# Altium schematic sheet DC075B_INPUT_CLOCKS.SchDoc: INPUT CLOCKS
size 558 x 431 mm; DrawnBy: Praveen Aroul; DocumentNumber: 3; SheetNumber: 3; SheetTotal: 13; PageSetup: Record=PageOptions|CenterHorizontal=True|CenterVertical=True|PrintScale=1.00|XCorrection=1.00|YCorrection=1.00|PrintKind=0|BorderSize=5000000|LeftOffset=0|BottomOffset=0|Orientation=2|PaperLength=1000|PaperWidth=1000|Scale=100|PaperSource=15|PrintQuality=600|MediaType=1|DitherType=10|PaperKind=Letter|PrintScaleMode=1
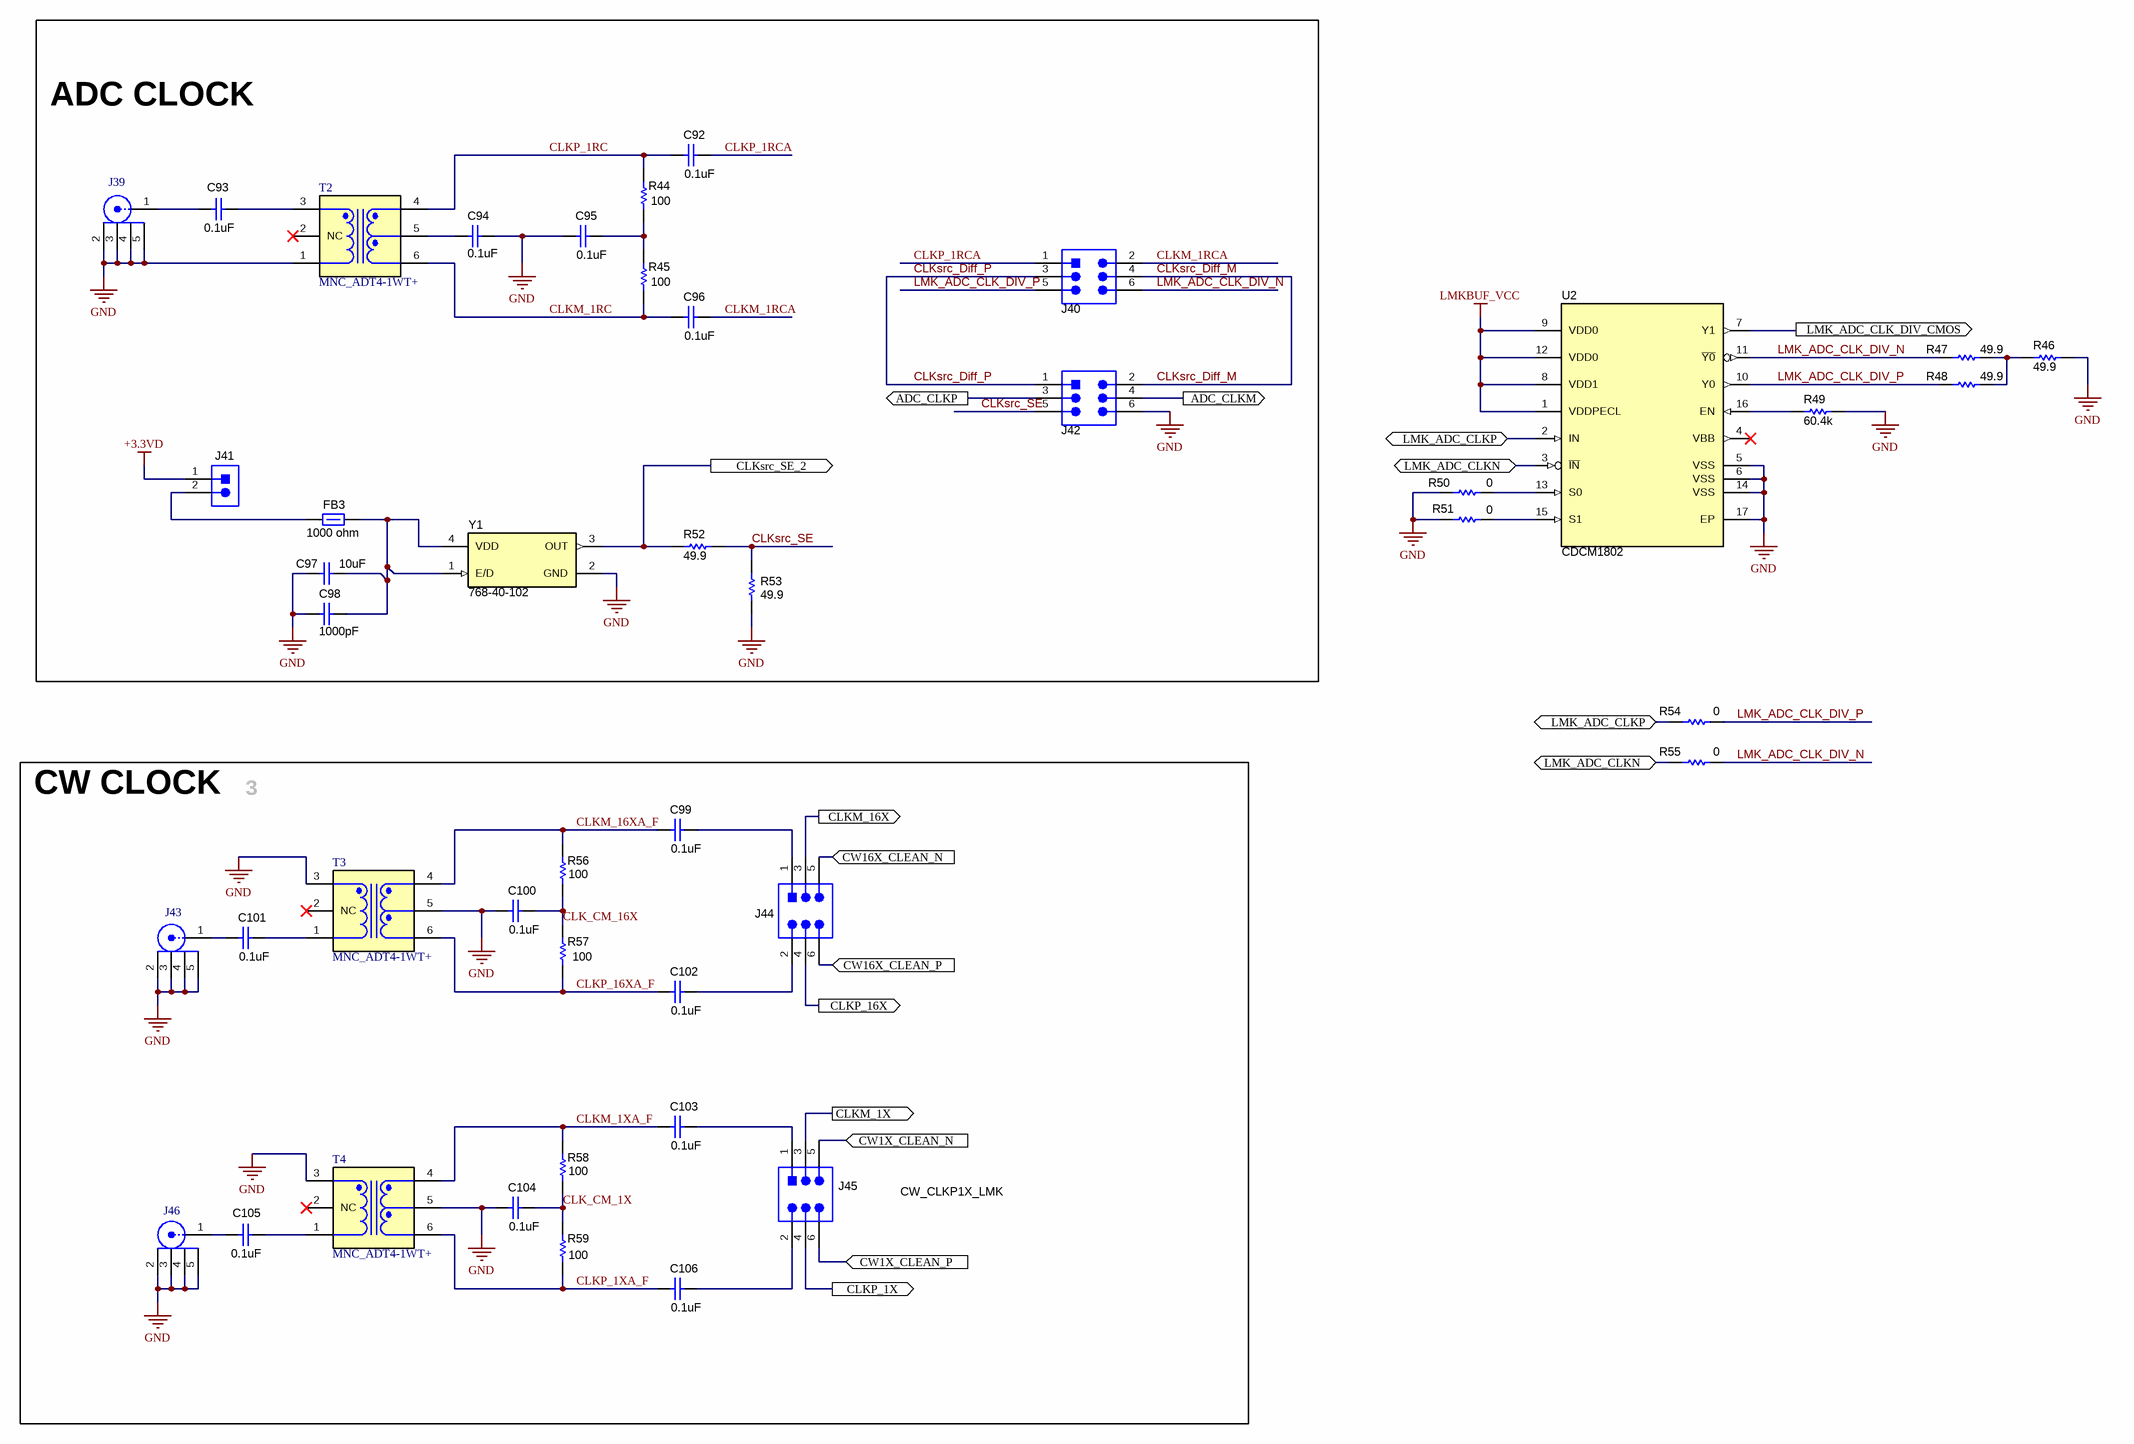
[diagram p0: DC075B_INPUT_CLOCKS.SchDoc]

## Parts
C92  value 0.1uF  [0402]  (hidden comment: Capacitor)
C93  value 0.1uF  [0402]  (hidden comment: Capacitor)
C94  value 0.1uF  [0402]  (hidden comment: Capacitor)
C95  value 0.1uF  [0402]  (hidden comment: Capacitor)
C96  value 0.1uF  [0402]  (hidden comment: Capacitor)
C97  value 10uF  [0603_HV]  (hidden comment: Capacitor)
C98  ValueDisplayed: 1000pF  [0402]  (hidden comment: 885012205044)
C99  value 0.1uF  [0402]  (hidden comment: Capacitor)
C100  value 0.1uF  [0402]  (hidden comment: Capacitor)
C101  value 0.1uF  [0402]  (hidden comment: Capacitor)
C102  value 0.1uF  [0402]  (hidden comment: Capacitor)
C103  value 0.1uF  [0402]  (hidden comment: Capacitor)
C104  value 0.1uF  [0402]  (hidden comment: Capacitor)
C105  value 0.1uF  [0402]  (hidden comment: Capacitor)
C106  value 0.1uF  [0402]  (hidden comment: Capacitor)
FB3  value 1000 ohm  [0402]  (hidden comment: Ferrite_Bead)
J39  5-1814832-1  [TE_5-1814832-1]  (value not drawn)
J40  Header_3x2  [TSW-103-07-G-D]  (value not drawn)
J41  Header_2x1  [TSW-102-07-G-S]  (value not drawn)
J42  Header_3x2  [TSW-103-07-G-D]  (value not drawn)
J43  5-1814832-1  [TE_5-1814832-1]  (value not drawn)
J44  Header_3x2  [TSW-103-07-G-D]  (value not drawn)
J45  Header_3x2  [TSW-103-07-G-D]  (value not drawn)
J46  5-1814832-1  [TE_5-1814832-1]  (value not drawn)
R44  ValueDisplayed: 100  [0402]  (hidden comment: Resistor)
R45  ValueDisplayed: 100  [0402]  (hidden comment: Resistor)
R46  value 49.9  [0402]  (hidden comment: Resistor)
R47  value 49.9  [0402]  (hidden comment: Resistor)
R48  value 49.9  [0402]  (hidden comment: Resistor)
R49  value 60.4k  [0402]  (hidden comment: Resistor)
R50  value 0  [0402]  (hidden comment: Resistor)
R51  value 0  [0402]  (hidden comment: Resistor)
R52  value 49.9  [0402]  (hidden comment: Resistor)
R53  value 49.9  [0402]  (hidden comment: Resistor)
R54  value 0  [0402]  (hidden comment: Resistor)
R55  value 0  [0402]  (hidden comment: Resistor)
R56  ValueDisplayed: 100  [0402]  (hidden comment: Resistor)
R57  ValueDisplayed: 100  [0402]  (hidden comment: Resistor)
R58  ValueDisplayed: 100  [0402]  (hidden comment: Resistor)
R59  ValueDisplayed: 100  [0402]  (hidden comment: Resistor)
T2  MNC_ADT4-1WT+  [MNC_CD542]
T3  MNC_ADT4-1WT+  [MNC_CD542]
T4  MNC_ADT4-1WT+  [MNC_CD542]
U2  CDCM1802  [RGT0016A]
Y1  768-40-102  [FOX_FXO-HC73]

## Blocks framed on the sheet
ADC CLOCK: C92-C98 FB3 J39-J42 R44 R45 R52 R53 T2 Y1
CW CLOCK: C99-C106 J43-J46 R56-R59 T3 T4

## Ports
ADC_CLKM (out), ADC_CLKP (out), CLKM_1X (out), CLKM_16X (out), CLKP_1X (out), CLKP_16X (out), CLKsrc_SE_2 (out), CW1X_CLEAN_N (in), CW1X_CLEAN_P (in), CW16X_CLEAN_N (in), CW16X_CLEAN_P (in), LMK_ADC_CLK_DIV_CMOS (out), LMK_ADC_CLKN, LMK_ADC_CLKP

## Nets
+3.3VD: J41.1
GND: C94.2 C95.2 C97.1 C98.1 C100.2 C104.2 J39.2 J39.3 J39.4 J39.5 J42.6 J43.2 J43.3 J43.4 J43.5 J46.2 J46.3 J46.4 J46.5 R46.2 R49.1 R50.1 R51.1 R53.2 T2.1 T3.3 T3.5 T4.3 T4.5 U2.5(VSS) U2.6(VSS) U2.14(VSS) U2.17(EP) Y1.2(GND)
LMKBUF_VCC: U2.1(VDDPECL) U2.8(VDD1) U2.9(VDD0) U2.12(VDD0)
ADC_CLKM: J42.4 ; port ADC_CLKM
ADC_CLKP: J42.3 ; port ADC_CLKP
CLK_CM_1X: C104.1 R58.1 R59.2
CLK_CM_16X: C100.1 R56.1 R57.2
CLKM_1RC: C96.2 R45.2 T2.6
CLKM_1RCA: C96.1 J40.2
CLKM_1X: J45.3 ; port CLKM_1X
CLKM_1XA_F: C103.2 R58.2 T4.4
CLKM_16X: J44.3 ; port CLKM_16X
CLKM_16XA_F: C99.2 R56.2 T3.4
CLKP_1RC: C92.2 R44.1 T2.4
CLKP_1RCA: C92.1 J40.1
CLKP_1X: J45.4 ; port CLKP_1X
CLKP_1XA_F: C106.2 R59.1 T4.6
CLKP_16X: J44.4 ; port CLKP_16X
CLKP_16XA_F: C102.2 R57.1 T3.6
CLKsrc_Diff_M: J40.4 J42.2
CLKsrc_Diff_P: J40.3 J42.1
CLKsrc_SE: J42.5 R52.2 R53.1
CLKsrc_SE_2: R52.1 Y1.3(OUT) ; port CLKsrc_SE_2
CW1X_CLEAN_N: J45.5 ; port CW1X_CLEAN_N
CW1X_CLEAN_P: J45.6 ; port CW1X_CLEAN_P
CW16X_CLEAN_N: J44.5 ; port CW16X_CLEAN_N
CW16X_CLEAN_P: J44.6 ; port CW16X_CLEAN_P
LMK_ADC_CLK_DIV_CMOS: U2.7(Y1) ; port LMK_ADC_CLK_DIV_CMOS
LMK_ADC_CLK_DIV_N: J40.6 R47.2 R55.1 U2.11(~{Y0})
LMK_ADC_CLK_DIV_P: J40.5 R48.2 R54.1 U2.10(Y0)
LMK_ADC_CLKN: R55.2 U2.3(~{IN}) ; port LMK_ADC_CLKN
LMK_ADC_CLKP: R54.2 U2.2(IN) ; port LMK_ADC_CLKP
NetC93_1: C93.1 T2.3
NetC93_2: C93.2 J39.1
NetC94_1: C94.1 T2.5
NetC95_1: C95.1 R44.2 R45.1
NetC97_2: C97.2 C98.2 FB3.1 Y1.1(E/D) Y1.4(VDD)
NetC99_1: C99.1 J44.1
NetC101_1: C101.1 T3.1
NetC101_2: C101.2 J43.1
NetC102_1: C102.1 J44.2
NetC103_1: C103.1 J45.1
NetC105_1: C105.1 T4.1
NetC105_2: C105.2 J46.1
NetC106_1: C106.1 J45.2
NetFB3_2: FB3.2 J41.2
NetR46_1: R46.1 R47.1 R48.1
NetR49_2: R49.2 U2.16(EN)
NetR50_2: R50.2 U2.13(S0)
NetR51_2: R51.2 U2.15(S1)

Not connected (* = marked no-connect by the designer): T2 2(NC)*; T3 2(NC)*; T4 2(NC)*; U2 4(VBB)*

## Notes on the sheet
- 3
- CW_CLKP1X_LMK
- Drawn By:
- SVN Rev:
- Number:
- TID #:
- Orderable:
- Rev:
- Sheet Title:
- File:
- Project Title:
- Designed for:
- Assembly Variant:
- Mod. Date:
- Sheet:
- Size:
- of
- C
- http://www.ti.com
- Texas Instruments and/or its licensors do not warrant the accuracy or completeness of this specification or any information contained therein. Texas Instruments and/or its licensors do not warrant that this design will meet the specifications, will be suitable for your application or fit for any particular purpose, or will operate in an implementation. Texas Instruments and/or its licensors do not warrant that the design is production worthy. You should completely validate and test your design implementation to confirm the system functionality for your application.
- Engineer:
- Contact:
- © Texas Instruments

## Library data of the parts
C92-C96 C99-C106 = CMP-0006641-2: CAP, CERM, 0.1 uF, 16 V, +/- 10%, X7R, 0402; PartNumber: GRM155R71C104KA88D; Manufacturer: MuRata; Polarized: N; U/M: EA; Cap_F: 100nF; Value1: Unknown; VDC_V: 16V; TaMin_C: -55°C; TaMax_C: 125°C; AEC Category: Q200; SizeArea_mm2: 0.5; SizeAreaWB_mm2: 3; SizeX_mm: 1; SizeZ_mm: 0.6; CompType: Capacitor; PackageReference: 0402; RoHS: Y; MountType: SMT; ComponentLink1Description: Datasheet link; ComponentLink1URL: http://search.murata.co.jp/Ceramy/PnsearchViewAction.do?HnOFG=ON&HnNFG=ON&SEL_CNT=50&sLang=en&sKey=GRM155R71C104KA88D&x=9&y=9&search=startwith; ValueDisplayed: 0.1uF; Tolerance_%: 10%; Value2: 16V; Technology: Ceramic; TempCo: X7R; Cap_Case: 0402; Published: 2008-06-19; Publisher: Texas Instruments; LatestRevisionDate: 2017-03-09; Supplier 1: Digi-Key; Supplier Part Number 1: 490-3261-1-ND; Supplier 2: Newark; Supplier Part Number 2: 38K1647; Supplier 3: Mouser; Supplier Part Number 3: 81-GRM155R71C104KA88; AEC Qualified: ?; SizeY_mm: 0.5
C97 = CMP-0006872-5: CAP, CERM, 10 uF, 6.3 V, +/- 20%, X5R, 0603; PartNumber: C0603C106M9PACTU; Manufacturer: Kemet; Polarized: N; U/M: EA; Cap_F: 10µF; ESR_ohm: 4m; Value1: 0.004 ohm; VDC_V: 6.3V; IRMS_A: 8.9A; TaMin_C: -55°C; TaMax_C: 85°C; Cap_Case: 0603; AEC Category: Q200; SizeArea_mm2: 1.28; SizeAreaWB_mm2: 4.68; SizeX_mm: 1.6; SizeY_mm: 0.8; SizeZ_mm: 1; CompType: Capacitor; PackageReference: 0603; RoHS: Y; MountType: SMT; ComponentLink1Description: Datasheet link; ComponentLink1URL: http://www.kemet.com/kemet/web/homepage/kechome.nsf/vapubfiles/F3102_Y5V.pdf/$file/F3102_Y5V.pdf; ValueDisplayed: 10uF; Tolerance_%: 20%; Value2: 6.3V; Technology: Ceramic; TempCo: X5R; Published: 2008-06-19; Publisher: Texas Instruments; LatestRevisionDate: 2017-03-09; Supplier 1: Digi-Key; Supplier Part Number 1: 399-5504-1-ND; Supplier 2: Mouser; Supplier Part Number 2: 80-C0603C106M9P; Supplier 3: Farnell; Supplier Part Number 3: 1288201; AEC Qualified: ?
C98 = CMP-0006229-2: CAP, CERM, 1000 pF, 25 V, +/- 10%, X7R, 0402; Manufacturer: Wurth Elektronik; TaMin_C: -55°C; Polarized: N; SizeAreaWB_mm2: 3; Value1: Unknown; U/M: EA; Value: 1000pF; TaMax_C: 125°C; SizeZ_mm: 0.6; SizeX_mm: 1; SizeY_mm: 0.5; Value2: 25V; CompType: Capacitor; Cap_F: 1nF; AEC Category: Q200; Publisher: Texas Instruments; TempCo: X7R; Published: 2008-06-19; RoHS: Y; MountType: SMT; Supplier 1: Mouser; PackageReference: 0402; Tolerance_%: 10%; Cap_Case: 0402; SizeArea_mm2: 0.5; LatestRevisionDate: 2017-03-09; PartNumber: 885012205044; AEC Qualified: N; VDC_V: 25V; ComponentLink1Description: Datasheet link; AEC Grade: N/A; Supplier Part Number 1: 710-885012205044; Technology: Ceramic; ComponentLink1URL: http://katalog.we-online.de/pbs/datasheet/885012205044.pdf
FB3 = CMP-0003310-1: Ferrite Bead, 1000 ohm @ 100 MHz, 0.3 A, 0402; PartNumber: BLM15AG102SN1D; Manufacturer: MuRata; Imax_A: 3dA; DCR_ohm: 6.5d; Value1: 0.65 ohm; Value2: 0.3A; ZTyp@100MHz_Ohm: 1k; SizeArea_mm2: 0.5; SizeAreaWB_mm2: 3; SizeX_mm: 1; SizeZ_mm: 0.6; CompType: Ferrite Bead; MountType: SMT; PackageReference: 0402; Published: 2014-04-30; Publisher: Texas Instruments; LatestRevisionDate: 2017-03-09; ComponentLink1Description: Datasheet link; ComponentLink1URL: http://search.murata.co.jp/Ceramy/image/img/PDF/ENG/L0110S0100BLM15AG_SN.pdf; RoHS: Y; Supplier 1: Digi-Key; Supplier Part Number 1: 490-1007-1-ND; Supplier 2: Newark; Supplier Part Number 2: 73M9022; Supplier 3: Mouser; Supplier Part Number 3: 81-BLM15AG102SN1D; SizeY_mm: 0.5; ValueDisplayed: 1000 ohm
J39 J43 J46 = CMP-0054990-1: SMA Straight PCB Socket Die Cast, 50 Ohm, TH; Manufacturer: TE Connectivity; Green_Lifecycle: Active; Green_REACh: Passed; CNHeader: FALSE; CT: TRUE; PartNumber: 5-1814832-1; PackageReference: SMA Straight PCB Socket Die Cast, TH; CompType: SMA; RoHS: Y; MountType: TH; ComponentLink1Description: Datasheet URL; ComponentLink1URL: http://www.te.com/commerce/DocumentDelivery/DDEController?Action=srchrtrv&DocNm=1814832&DocType=Customer+Drawing&DocLang=English; Supplier 1: Digi-Key; Supplier Part Number 1: A97594-ND; Supplier 2: Newark; Supplier Part Number 2: 78M7270; Supplier 3: Mouser; Supplier Part Number 3: 571-5-1814832-1; Green_EU RoHS-2: Incomplete; Green_EU RoHS: Passed with Exemption; Publisher: Texas Instruments; LatestRevisionDate: 26/05/2017
J40 J42 J44 J45 = CMP-0075406-2: Header, 100mil, 3x2, Gold, TH; Manufacturer: Samtec; Cert_CSA: Y; Cert_CULUS: N; Current_A: 6.3A; Gender: Male; Green_Lifecycle: Active; Green_REACh: Passed; Pitch_mm: 2.54; Row_Count: 2; Voltage_V: 550V; PartNumber: TSW-103-07-G-D; ClassName: Header; PackageReference: 3x2 Header; CompType: Header; RoHS: Y; MountType: TH; ComponentLink1Description: Datasheet URL; ComponentLink1URL: http://samtec.com/ftppub/pdf/TSW_TH.PDF; Supplier 1: Digi-Key; Supplier Part Number 1: SAM1028-03-ND; Cert_UL: Y; Cert_VDE: N; Color: Black; ContactFinish: Gold; Green_EU RoHS-2: Passed; Green_EU RoHS: Passed; Orientation: Vertical; PinCount: 6; RowSpacing_mm: 2.54; Shrouded: N
J41 = CMP-0075405-2: Header, 100mil, 2x1, Gold, TH; Manufacturer: Samtec; Cert_CSA: Y; Cert_CULUS: N; Current_A: 6.3A; Gender: Male; Green_Lifecycle: Active; Green_REACh: Passed; Pitch_mm: 2.54; Row_Count: 1; Voltage_V: 550V; PartNumber: TSW-102-07-G-S; ClassName: Header; PackageReference: 2x1 Header; CompType: Header; RoHS: Y; MountType: TH; ComponentLink1Description: Datasheet URL; ComponentLink1URL: http://samtec.com/ftppub/pdf/TSW_TH.PDF; Supplier 1: Digi-Key; Supplier Part Number 1: SAM1029-02-ND; Cert_UL: Y; Cert_VDE: N; Color: Black; ContactFinish: Gold; Green_EU RoHS-2: Passed; Green_EU RoHS: Passed; Orientation: Vertical; PinCount: 2; Shrouded: N
R44 R45 R56-R59 = CMP-0026656-1: RES, 100, 1%, 0.1 W, 0402; Manufacturer: Panasonic; PartNumber: ERJ-2RKF1000X; Value: 100; Value_Code: 100R; Power_W: 100mW; Value2: 0.1W; VDC_V: 50V; TempCo: 100 ppm/C; EIA_Code: E96; U/M: EA; AEC Category: Q200; SizeArea_mm2: 0.5; SizeX_mm: 1; SizeZ_mm: 0.6; ComponentLink1Description: Datasheet link; ComponentLink1URL: http://industrial.panasonic.com/www-data/pdf/AOA0000/AOA0000CE2.pdf; CompType: Resistor; MountType: SMT; PackageReference: 0402; RoHS: Y; Res_ohm: 100; Tolerance_%: 1%; Value1: 1%; Technology: Thick Film; Published: 2008-06-26; Publisher: Texas Instruments; LatestRevisionDate: 2017-03-09; Supplier 1: Digi-Key; Supplier Part Number 1: P100LCT-ND; Supplier 2: Newark; Supplier Part Number 2: 64R5246; Supplier 3: Mouser; Supplier Part Number 3: 667-ERJ-2RKF1000X; AEC Qualified: ?; SizeY_mm: 0.5
R46-R48 R52 R53 = CMP-0026404-2: RES, 49.9, 1%, 0.063 W, AEC-Q200 Grade 0, 0402; Manufacturer: Vishay-Dale; PartNumber: CRCW040249R9FKED; Value_Code: 49R9; Power_W: 63mW; Value2: 0.063W; VDC_V: 50V; TempCo: 100 ppm/C; EIA_Code: E96; AEC Category: Q200; AEC Grade: 0; AEC Qualified: Y; SizeArea_mm2: 0.5; SizeX_mm: 1; SizeZ_mm: 0.6; ComponentLink1Description: Datasheet link; ComponentLink1URL: http://www.vishay.com/docs/20035/dcrcwe3.pdf; CompType: Resistor; MountType: SMT; PackageReference: 0402; RoHS: E; ValueDisplayed: 49.9; Res_ohm: 49.9; Tolerance_%: 1%; Value1: 1%; Technology: Thick Film; Supplier 1: Digi-Key; Supplier Part Number 1: 541-49.9LCT-ND; Supplier 2: Newark; Supplier Part Number 2: 52K7114; Supplier 3: Mouser; Supplier Part Number 3: 71-CRCW0402-49.9-E3; SizeY_mm: 0.5
R49 = CMP-0026486-2: RES, 60.4 k, 1%, 0.063 W, AEC-Q200 Grade 0, 0402; PartNumber: CRCW040260K4FKED; Manufacturer: Vishay-Dale; Value_Code: 60k4; Power_W: 63mW; Value2: 0.063W; VDC_V: 50V; TempCo: 100 ppm/C; EIA_Code: E96; AEC Category: Q200; AEC Grade: 0; AEC Qualified: Y; SizeArea_mm2: 0.5; SizeX_mm: 1; SizeZ_mm: 0.6; CompType: Resistor; PackageReference: 0402; RoHS: E; Res_ohm: 60.4k; Tolerance_%: 1%; Value1: 1%; MountType: SMT; Technology: Thick Film; ComponentLink1Description: Datasheet link; ComponentLink1URL: http://www.vishay.com/docs/20035/dcrcwe3.pdf; Supplier 1: Digi-Key; Supplier Part Number 1: 541-60.4KLCT-ND; Supplier 2: Newark; Supplier Part Number 2: 52K7190; Supplier 3: Mouser; Supplier Part Number 3: 71-CRCW0402-60.4K-E3; SizeY_mm: 0.5; ValueDisplayed: 60.4k
R50 R51 R54 R55 = CMP-0026822-3: RES, 0, 5%, 0.063 W, AEC-Q200 Grade 0, 0402; Manufacturer: Vishay-Dale; PartNumber: CRCW04020000Z0ED; Value_Code: 0000; Power_W: 63mW; Value2: 0.063W; VDC_V: 50V; TempCo: 200 ppm/C; EIA_Code: E24; AEC Category: Q200; AEC Qualified: Y; SizeArea_mm2: 0.5; SizeX_mm: 1; SizeZ_mm: 0.6; ComponentLink1Description: Datasheet link; ComponentLink1URL: http://www.vishay.com/docs/20035/dcrcwe3.pdf; CompType: Resistor; MountType: SMT; PackageReference: 0402; RoHS: E; ValueDisplayed: 0; Res_ohm: 0; Tolerance_%: 5%; Value1: 5%; Technology: Thick Film; Supplier 1: Digi-Key; Supplier Part Number 1: 541-0.0JCT-ND; Supplier 2: Newark; Supplier Part Number 2: 52K6543; Supplier 3: Mouser; Supplier Part Number 3: 71-CRCW0402-0-E3; AEC Grade: 0; SizeY_mm: 0.5
T2-T4 = CMP-0030461-2: RF Transformer, 50 ohm, 2 to 775 MHz, SMT; Manufacturer: Minicircuits; Green_Lifecycle: Not Set; Green_REACh: Incomplete; PartNumber: ADT4-1WT+; CompType: Transformer; PackageReference: CD542; MountType: SMT; RoHS: Y; ComponentLink1Description: Datasheet URL; ComponentLink1URL: http://www.minicircuits.com/pdfs/ADT4-1WT.pdf; Publisher: Texas Instruments; LatestRevisionDate: 2017-05-09; Green_EU RoHS-2: Incomplete; Green_EU RoHS: Incomplete
U2 = CMP-0065659-2: Clock Buffer w/Programmable Divider, LVPECL I/O + addl LVCMOS output, RGT0016A (VQFN-16); PartNumber: CDCM1802RGTR; Alternate PartNumber: CDCM1802RGTT; Manufacturer: Texas Instruments; CompType: IC; U/M: EA; SizeArea_mm2: 16.0; SizeAreaWB_mm2: 25.0; SizeX_mm: 4.0; SizeZ_mm: 1.0; PackageReference: RGT0016A; MountType: SMT; ComponentLink1Description: Datasheet Link; ComponentLink1URL: http://www.ti.com/lit/ds/symlink/cdcm1802.pdf; RoHS: Y; Publisher: Texas Instruments; LatestRevisionDate: 2017-06-09; Alternate Manufacturer: Texas Instruments; PackageDescription: VQFN-16; SizeY_mm: 4.0
Y1 = CMP-0085605-1: Crystal, 40 MHz, SMD; Manufacturer: Fox Electronics; TaMin_C: -40°C; TaMax_C: 85°C; Frequency Stability: 25 ppm; AEC Category: Q200; AEC Qualified: N; Frequency_Fixed: 40MHz; PartNumber: 768-40-102; CompType: Crystal; PackageReference: SMD, 4-Leads, Body 7x5mm; MountType: SMT; RoHS: Y; ComponentLink1Description: Datasheet Link; ComponentLink1URL: http://www.foxonline.com/pdfs/FXO_HC73.pdf; AEC Grade: N/A